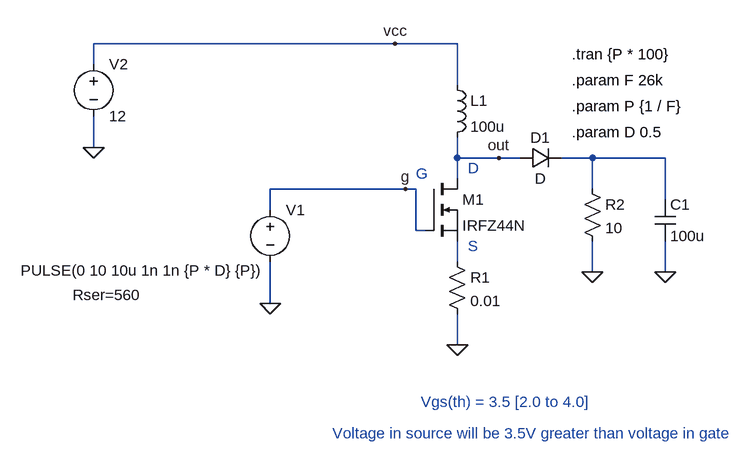
[diagram p0: schematic boost-converter-ideal.asc]
boost-converter-ideal.asc, the LTspice schematic file:
Version 4
SHEET 1 948 680
WIRE 416 32 -48 32
WIRE 512 32 416 32
WIRE -48 64 -48 32
WIRE 512 96 512 32
WIRE -48 192 -48 144
WIRE 512 208 512 176
WIRE 576 208 512 208
WIRE 608 208 576 208
WIRE 720 208 672 208
WIRE 832 208 720 208
WIRE 512 240 512 208
WIRE 432 256 224 256
WIRE 448 256 432 256
WIRE 720 256 720 208
WIRE 832 272 832 208
WIRE 224 288 224 256
WIRE 448 320 448 256
WIRE 464 320 448 320
WIRE 512 368 512 336
WIRE 720 384 720 336
WIRE 832 384 832 336
WIRE 224 432 224 368
WIRE 512 496 512 448
FLAG 224 432 0
FLAG -48 192 0
FLAG 512 496 0
FLAG 576 208 out
FLAG 432 256 g
FLAG 832 384 0
FLAG 720 384 0
FLAG 416 32 vcc
SYMBOL voltage 224 272 R0
WINDOW 3 -384 109 Left 2
WINDOW 39 -304 147 Left 2
SYMATTR Value PULSE(0 10 10u 1n 1n {P * D} {P})
SYMATTR SpiceLine Rser=560
SYMATTR InstName V1
SYMBOL voltage -48 48 R0
WINDOW 39 24 38 Left 2
SYMATTR InstName V2
SYMATTR Value 12
SYMBOL ind 496 80 R0
SYMATTR InstName L1
SYMATTR Value 100u
SYMATTR SpiceLine Rser=0.35
SYMBOL Res 704 240 R0
SYMATTR InstName R2
SYMATTR Value 10
SYMBOL Cap 816 272 R0
SYMATTR InstName C1
SYMATTR Value 100u
SYMBOL Diode 608 192 M90
WINDOW 0 0 32 VBottom 2
WINDOW 3 32 32 VTop 2
SYMATTR InstName D1
SYMBOL nmos 464 240 R0
SYMATTR InstName M1
SYMATTR Value IRFZ44N
SYMBOL Res 496 352 R0
SYMATTR InstName R1
SYMATTR Value 0.01
TEXT 688 48 Left 2 !.tran {P * 100}
TEXT 456 584 Left 2 ;Vgs(th) = 3.5 [2.0 to 4.0]
TEXT 320 632 Left 2 ;Voltage in source will be 3.5V greater than voltage in gate
TEXT 528 344 Left 2 ;S
TEXT 528 224 Left 2 ;D
TEXT 448 232 Left 2 ;G
TEXT 688 88 Left 2 !.param F 26k
TEXT 688 128 Left 2 !.param P {1 / F}
TEXT 688 168 Left 2 !.param D 0.5

The netlist it stands for:
* boost-converter-ideal.asc
V1 g 0 PULSE(0 10 10u 1n 1n {P * D} {P}) Rser=560
V2 vcc 0 12
L1 vcc out 100u Rser=0.35
R2 N001 0 10
C1 N001 0 100u
D1 out N001 D
M1 out g N002 N002 IRFZ44N
R1 N002 0 0.01
.model D D
.lib standard.dio
.model NMOS NMOS
.model PMOS PMOS
.lib standard.mos
.tran {P * 100}
* Vgs(th) = 3.5 [2.0 to 4.0]
* Voltage in source will be 3.5V greater than voltage in gate
* S
* D
* G
.param F 26k
.param P {1 / F}
.param D 0.5
.backanno
.end